# Altium schematic sheet Power.SchDoc
size A4
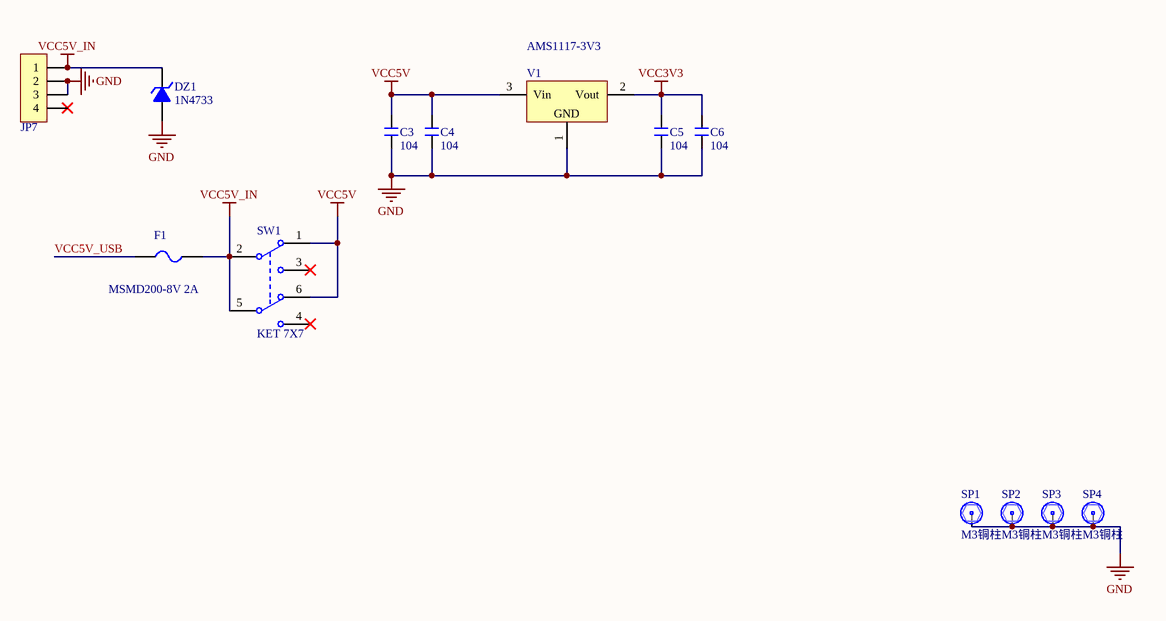
[diagram p0: Power.SchDoc]

## Parts
C3  104  [C 1812_L]
C4  104  [C 1812_L]
C5  104  [C 1206_M]
C6  104  [C 1206_M]
DZ1  1N4733  [SMA]
F1  MSMD200-8V 2A  [FU 1210]
JP7  HDR-1X4  [VH3.96-LI-4P]  (value not drawn)
SP1  M3铜柱  [M3x4_L]
SP2  M3铜柱  [M3x4_L]
SP3  M3铜柱  [M3x4_L]
SP4  M3铜柱  [M3x4_L]
SW1  KET 7X7  [KFT DIP-7X7]
V1  AMS1117-3V3  [SOT223_L]

## Nets
GND: C3.1 C4.1 C5.1 C6.1 DZ1.1(A) JP7.2 JP7.3 SP1.1 SP2.1 SP3.1 SP4.1 V1.1(GND)
VCC3V3: C5.2 C6.2 V1.2(Vout)
VCC5V: C3.2 C4.2 SW1.1(NC1) SW1.6(NC2) V1.3(Vin)
VCC5V_IN: DZ1.2(K) F1.2 JP7.1 SW1.2(COM2) SW1.5(COM2)
VCC5V_USB: F1.1

Not connected (* = marked no-connect by the designer): JP7 4*; SW1 3(NO1)* 4(NO2)*

## Library data of the parts
C3-C6 = C: 无极性贴片电容; 版权归属: 源创客; BOM名称: 无极性贴片电容; 学习资源: www.ooocke.com
DZ1 = 1N4733: 5.1V/1W稳压管; 版权归属: 源创客; BOM名称: 5.1V/1W稳压管; 学习资源: www.ooocke.com
F1 = FU: 贴片保险丝; 版权归属: 源创客; BOM名称: 贴片保险丝; 学习资源: www.ooocke.com
JP7 = Header 4: 4P接插件; 版权归属: 源创客; BOM名称: 4P接插件; 学习资源: www.ooocke.com
SP1-SP4 = 铜柱小焊盘: 铜柱; 版权归属: 源创客; BOM名称: 铜柱; 学习资源: www.ooocke.com
SW1 = KET 7X7: 7*7自锁开关; 版权归属: 源创客; BOM名称: 7*7自锁开关; 学习资源: www.ooocke.com
V1 = AMS1117: 三端稳压芯片; BOM名称: 稳压芯片; 版权归属: 源创客; 学习资源: www.ooocke.com